# EAGLE schematic receiver (EAGLE 9.6.2)
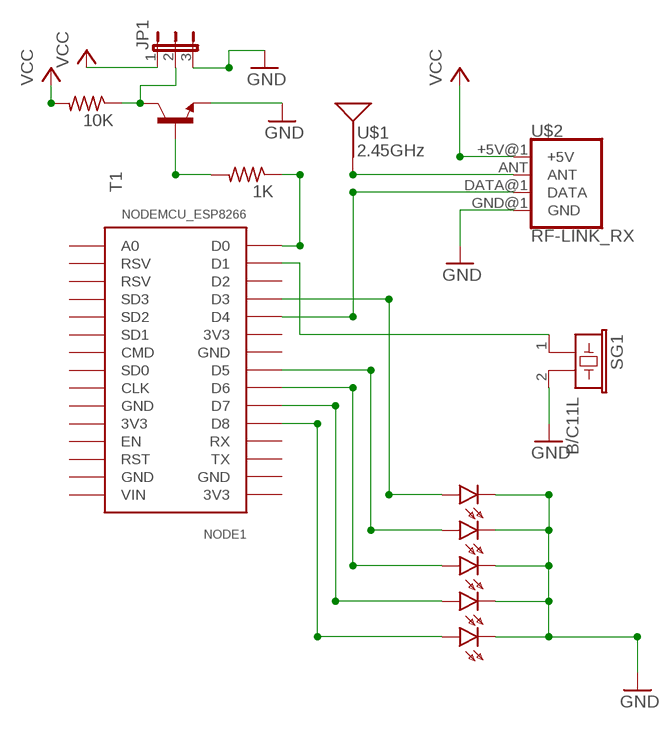
[diagram p0: schematic, sheet 1]

## Parts
D2  HLMP6  [HLMP6]
D3  HLMP6  [HLMP6]
D4  HLMP6  [HLMP6]
D5  HLMP6  [HLMP6]
D6  HLMP6  [HLMP6]
JP1  JP2E  [JP2]
NODE1  NODEMCU_ESP8266  [NODEMCU_ESP8266]
R1  1K  R-US_0207/12  [0207/12]
R5  10K  R-US_0207/12  [0207/12]
SG1  B/C11L  [B/C11L]
T1  2N4124-NPN-TO92-CBE  [TO92-CBE]
U$1  2.45GHz  ANTENNA2.4GHZ-6.5X2.2MM  [ANT-2.4GHZ-6.5X2.2MM]
U$2  RF-LINK_RX  [RF-LINK_RX]

## Nets
GND: D2.K D3.K D4.K D5.K D6.K JP1.3 SG1.2 T1.E U$2.GND@1(GND)
N$1: R1.2 T1.B
N$2: NODE1.D0 R1.1
N$3: JP1.2 R5.1 T1.C
N$4: NODE1.D4 U$2.DATA@1(DATA)
N$5: NODE1.D1 SG1.1
N$7: U$1.FEED(SIGNAL) U$2.ANT
N$10: D6.A NODE1.D8
N$11: D5.A NODE1.D7
N$12: D4.A NODE1.D6
N$13: D3.A NODE1.D5
N$15: D2.A NODE1.D3
VCC: JP1.1 R5.2 U$2.+5V@1(+5V)
Unconnected: NODE1.A0 NODE1.CLK NODE1.CMD NODE1.D2 NODE1.EN NODE1.RST NODE1.RSV1(RSV) NODE1.RSV2(RSV) NODE1.RX NODE1.SD1 NODE1.SD2 NODE1.SD3 NODE1.SDO(SD0) NODE1.TX

## Power pins joined to a net without a drawn wire
3V3: NODE1.3V3@1(3V3) NODE1.3V3@2(3V3) NODE1.3V3@3(3V3)
GND: NODE1.GND@1(GND) NODE1.GND@2(GND) NODE1.GND@3(GND) NODE1.GND@4(GND)
VIN: NODE1.VIN

## Library data of the parts
D2-D6 = display-hp:HLMP6: LED 2mm horizontal; MF: AGILENT TECHNOLOGIES; MPN: HLMP-6500; OC_FARNELL: 1652490; OC_NEWARK: 40K0088
JP1 = jumper:JP2E: JUMPER
NODE1 = nodemcu_esp8266:NODEMCU_ESP8266: Node MCU V2 (ESP8266) Created by Harish
R1 R5 = rcl:R-US_: RESISTOR, American symbol; SPICEPREFIX: R
SG1 = buzzer:B/C11L: BUZZER Source: Buerklin; OC_FARNELL: unknown; OC_NEWARK: unknown
T1 = transistor:*-NPN-: NPN Transistror BF959 corrected 2008.03.06
U$1 = SparkFun-RF:ANTENNA: Single-ended Antennae 2.4GHz and antennae with just one terminal. These are all chip antennae. 2.4GHz (WiFi/BT/ZigBee) Antennae ANT-2.4GHZ-6.5X2.2MM - 6.5 x 2.2 mm chip antenna. (SparkFun Product <https://www.sparkfun.com/products/144>) ANT-2.4GHZ8.0X1.0MM - 8.0 x 1.0 mm chip antenna. (Datasheet <http://www.mouser.com/ds/2/611/antenna_2500at44m0400-242425.pdf>) ANT-2.4GHZ9.5X2.0MM - 9.5 x 2.0 mm chip antenna. (SparkFun Product <https://www.sparkfun.com/products/9025>); PROD_ID: ANT-08187; SF_ID: WRL-00144
U$2 = SparkFun-RF:RF-LINK_RX: RF Link Receiver (434 MHz, 315 MHz) These wireless receivers work with equivalent transmitters. They can easily fit into a breadboard and work well with microcontrollers to create a very simple wireless data link. Since these are only receivers, they will only work communicating data one-way, you would need two pairs (of different frequencies) to act as a transmitter/receiver pair.. SparkFun Products RF Link Receiver - 4800bps (434 MHz) <https://www.sparkfun.com/products/10532>(WRL-10532); SF_ID: WRL-10533